# EAGLE schematic baru (EAGLE 7.6.0)
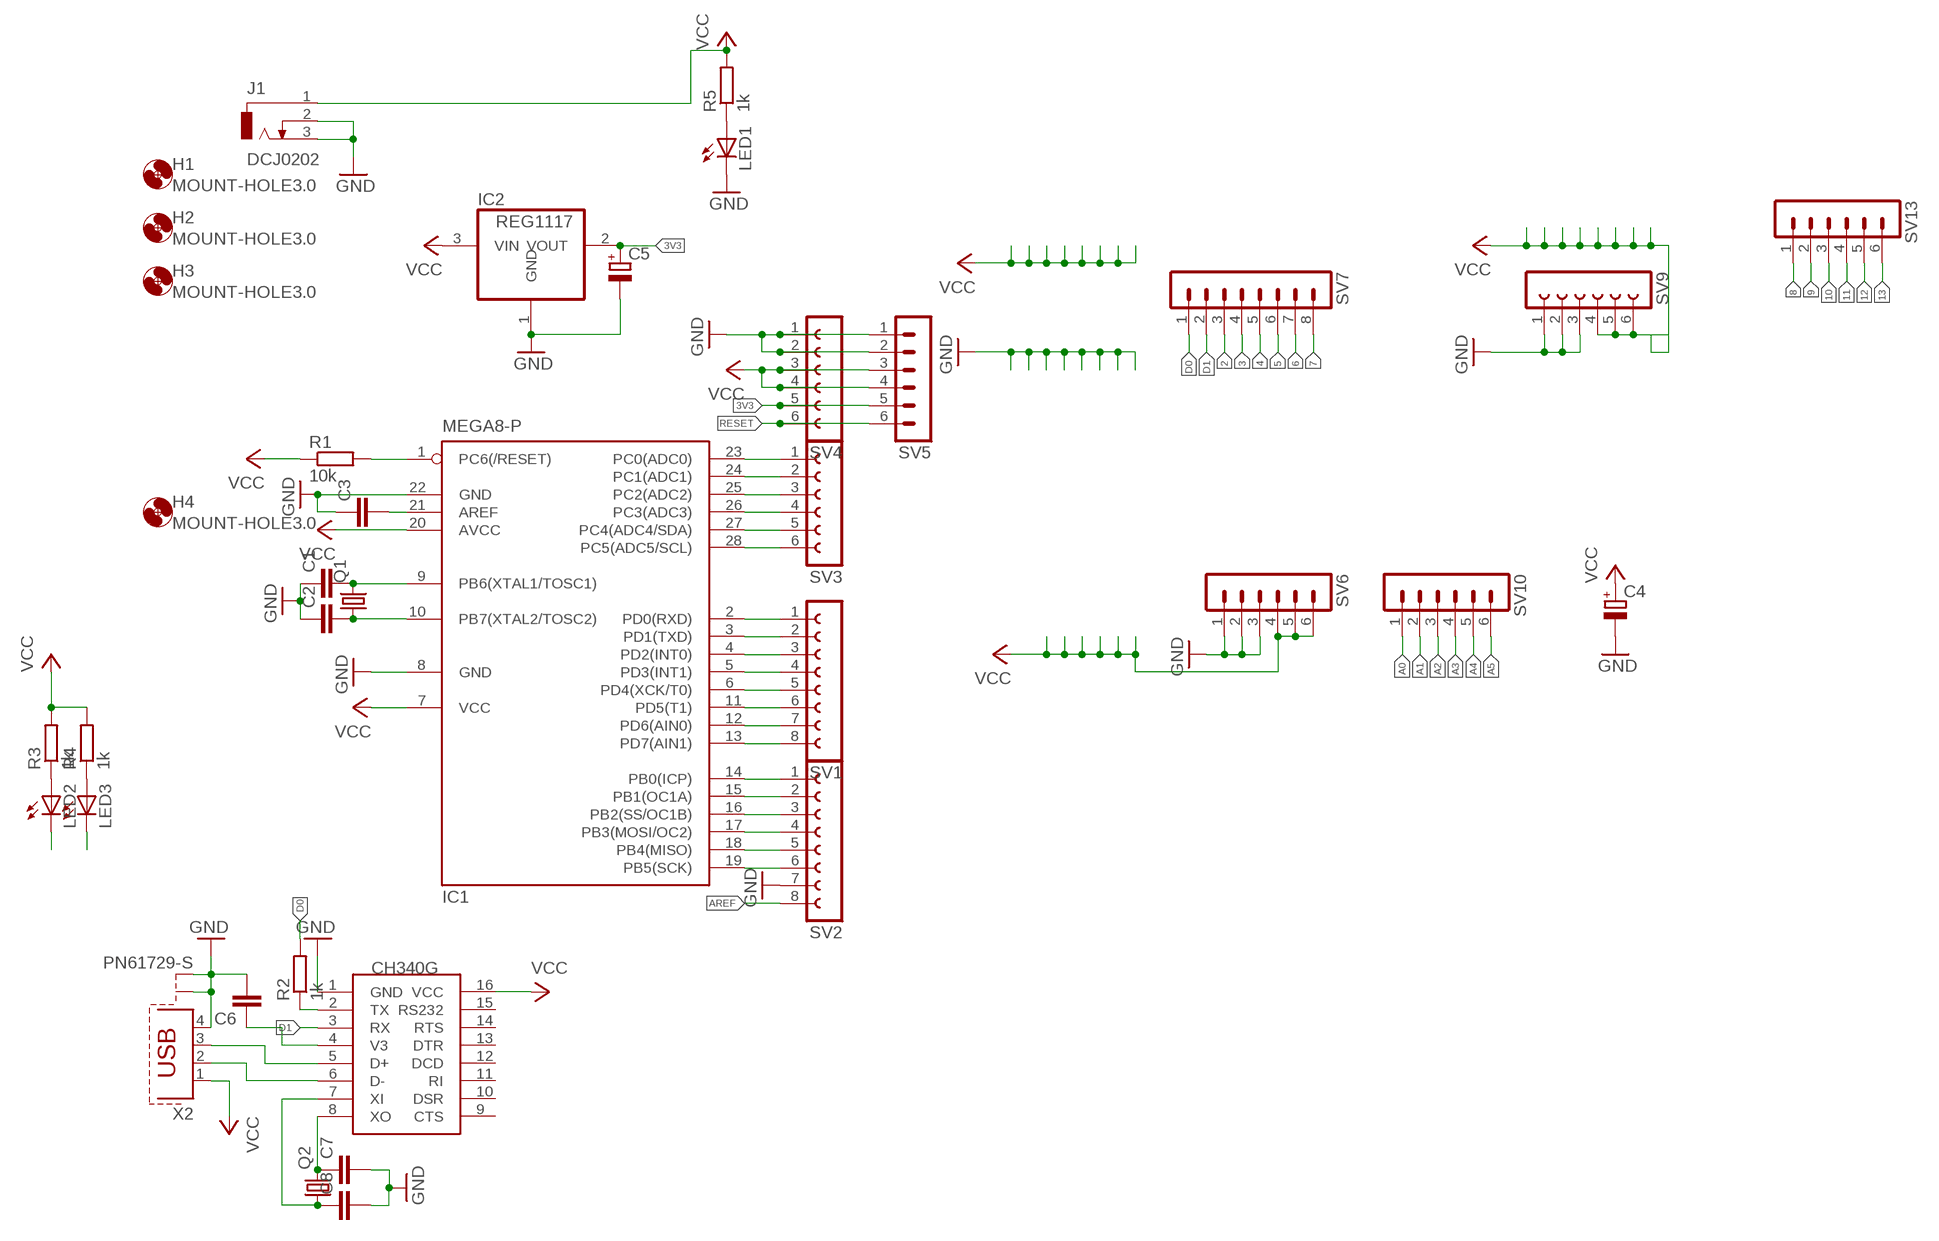
[diagram p0: schematic, sheet 1]

## Parts
C1  C-EU025-025X050  [C025-025X050]
C2  C-EU025-025X050  [C025-025X050]
C3  C-EU050-024X044  [C050-024X044]
C4  CPOL-EUE2.5-7  [E2,5-7]
C5  CPOL-EUE2.5-5  [E2,5-5]
C6  C-EU050-024X044  [C050-024X044]
C7  C-EU025-025X050  [C025-025X050]
C8  C-EU025-025X050  [C025-025X050]
H1  MOUNT-HOLE3.0  [3,0]
H2  MOUNT-HOLE3.0  [3,0]
H3  MOUNT-HOLE3.0  [3,0]
H4  MOUNT-HOLE3.0  [3,0]
IC1  MEGA8-P  [DIL28-3]
IC2  REG1117  [SOT223]
J1  DCJ0202  [DCJ0202]
LED1  LED3MM  [LED3MM]
LED2  LED3MM  [LED3MM]
LED3  LED3MM  [LED3MM]
Q1  CRYSTALHC49S  [HC49/S]
Q2  CRYSTALHC49S  [HC49/S]
R1  10k  R-EU_0207/10  [0207/10]
R2  1k  R-EU_0207/10  [0207/10]
R3  1k  R-EU_0207/10  [0207/10]
R4  1k  R-EU_0207/10  [0207/10]
R5  1k  R-EU_0207/10  [0207/10]
SV1  FE08-1  [FE08]
SV2  FE08-1  [FE08]
SV3  FE06-1  [FE06]
SV4  FE06-1  [FE06]
SV5  MA06-1  [MA06-1]
SV6  MA06-1  [MA06-1]
SV7  MA08-1  [MA08-1]
SV9  FE06-1  [FE06]
SV10  MA06-1  [MA06-1]
SV13  MA06-1  [MA06-1]
U$1  CH340G  [SOIC16]
X2  PN61729-S  [PN61729-S]

## Nets
2: IC1.4(PD2(INT0)) SV1.3 SV7.3
3: IC1.5(PD3(INT1)) SV1.4 SV7.4
3V3: C5.+ IC2.2(VOUT) SV4.5 SV5.5
4: IC1.6(PD4(XCK/T0)) SV1.5 SV7.5
5: IC1.11(PD5(T1)) SV1.6 SV7.6
6: IC1.12(PD6(AIN0)) SV1.7 SV7.7
7: IC1.13(PD7(AIN1)) SV1.8 SV7.8
8: IC1.14(PB0(ICP)) SV2.1 SV13.1
9: IC1.15(PB1(OC1A)) SV2.2 SV13.2
10: IC1.16(PB2(SS/OC1B)) SV2.3 SV13.3
11: IC1.17(PB3(MOSI/OC2)) SV2.4 SV13.4
12: IC1.18(PB4(MISO)) SV2.5 SV13.5
13: IC1.19(PB5(SCK)) SV2.6 SV13.6
A0: IC1.23(PC0(ADC0)) SV3.1 SV10.1
A1: IC1.24(PC1(ADC1)) SV3.2 SV10.2
A2: IC1.25(PC2(ADC2)) SV3.3 SV10.3
A3: IC1.26(PC3(ADC3)) SV3.4 SV10.4
A4: IC1.27(PC4(ADC4/SDA)) SV3.5 SV10.5
A5: IC1.28(PC5(ADC5/SCL)) SV3.6 SV10.6
AREF: C3.2 IC1.21(AREF) SV2.8
D0: IC1.2(PD0(RXD)) R2.2 SV1.1 SV7.1
D1: IC1.3(PD1(TXD)) LED2.K(C) SV1.2 SV7.2 U$1.3(RX)
GND: C1.1 C2.1 C3.1 C4.- C5.- C6.2 C7.2 C8.2 IC1.8(GND) IC1.22(GND) IC2.1(GND) J1.2 J1.3 LED1.K(C) SV2.7 SV4.1 SV4.2 SV5.1 SV5.2 SV6.1 SV6.2 SV6.3 SV9.1 SV9.2 SV9.3 U$1.1(GND) X2.4 X2.S1 X2.S2
N$2: U$1.6(D-) X2.2
N$3: U$1.5(D+) X2.3
N$4: C1.2 IC1.9(PB6(XTAL1/TOSC1)) Q1.2
N$5: C2.2 IC1.10(PB7(XTAL2/TOSC2)) Q1.1
N$6: C6.1 U$1.4(V3)
N$7: LED2.A R3.1
N$8: LED3.A R4.1
N$9: LED1.A R5.1
N$10: C7.1 Q2.2 U$1.8(XO)
N$11: C8.1 Q2.1 U$1.7(XI)
RESET: IC1.1(PC6(/RESET)) R1.2 SV4.6 SV5.6
TX: LED3.K(C) R2.1 U$1.2(TX)
VCC: C4.+ IC1.7(VCC) IC1.20(AVCC) IC2.3(VIN) J1.1 R1.1 R3.2 R4.2 R5.2 SV4.3 SV4.4 SV5.3 SV5.4 SV6.4 SV6.5 SV6.6 SV9.4 SV9.5 SV9.6 U$1.16(VCC) X2.1
Unconnected: U$1.9(CTS) U$1.10(DSR) U$1.11(RI) U$1.12(DCD) U$1.13(DTR) U$1.14(RTS) U$1.15(RS232)

## Library data of the parts
C1-C3 C6-C8 = rcl:C-EU: CAPACITOR, European symbol
C4 C5 = rcl:CPOL-EU: POLARIZED CAPACITOR, European symbol
H1-H4 = holes:MOUNT-HOLE: MOUNTING HOLE with drill center marker
IC1 = atmel:MEGA8-P: MICROCONTROLLER 8 Kbytes FLASH, 1 kbytes SRAM, 512 bytes EEPROM, USART, 4-channel 10 bit ADC, 2-channel 8 bit ADC Pin compatible with Atmega48, ATMega88, ATMega168 Source: avr.lbr; OC_FARNELL: unknown; OC_NEWARK: unknown
IC2 = burr-brown:REG1117: 800mA and 1A Low Dropout (LDO) Positive Regulator 1.8V, 2.5V, 2.85V, 3.3V, 5V, and Adj; MPN: REG1117; OC_FARNELL: 1097566; OC_NEWARK: 14P6981
J1 = con-jack:DCJ0202: DC POWER JACK Source: DCJ0202.pdf; OC_FARNELL: unknown; OC_NEWARK: unknown
LED1-LED3 = led:LED: LED OSRAM: - CHIPLED LG R971, LG N971, LY N971, LG Q971, LY Q971, LO R971, LY R971 LH N974, LH R974 LS Q976, LO Q976, LY Q976 LO Q996 - Hyper CHIPLED LW Q18S LB Q993, LB Q99A, LB R99A - SideLED LS A670, LO A670, LY A670, LG A670, LP A670 LB A673, LV A673, LT A673, LW A673 LH A674 LY A675 LS A676, LA A676, LO A676, LY A676, LW A676 LS A679, LY A679, LG A679 - Hyper Micro SIDELED® LS Y876, LA Y876, LO Y876, LY Y876 LT Y87S - SmartLED LW L88C, LW L88S LB L89C, LB L89S, LG L890 LS L89K, LO L89K, LY L89K LS L896, LA L896, LO L896, LY L896 - TOPLED LS T670, LO T670, LY T670, LG T670, LP T670 LSG T670, LSP T670, LSY T670, LOP T670, LYG T670 LG T671, LOG T671, LSG T671 LB T673, LV T673, LT T673, LW T673 LH T674 LS T676, LA T676, LO T676, LY T676, LB T676, LH T676, LSB T676, LW T676 LB T67C, LV T67C, LT T67C, LS T67K, LO T67K, LY T67K, LW E67C LS E67B, LA E67B, LO E67B, LY E67B, LB E67C, LV E67C, LT E67C LW T67C LS T679, LY T679, LG T679 LS T770, LO T770, LY T770, LG T770, LP T770 LB T773, LV T773, LT T773, LW T773 LH T774 LS E675, LA E675, LY E675, LS T675 LS T776, LA T776, LO T776, LY T776, LB T776 LHGB T686 LT T68C, LB T68C - Hyper Mini TOPLED® LB M676 - Mini TOPLED Santana® LG M470 LS M47K, LO M47K, LY M47K Source: http://www.osram.convergy.de LUXEON: - LUMILED® LXK2-PW12-R00, LXK2-PW12-S00, LXK2-PW14-U00, LXK2-PW14-V00 LXK2-PM12-R00, LXK2-PM12-S00, LXK2-PM14-U00 LXK2-PE12-Q00, LXK2-PE12-R00, LXK2-PE12-S00, LXK2-PE14-T00, LXK2-PE14-U00 LXK2-PB12-K00, LXK2-PB12-L00, LXK2-PB12-M00, LXK2-PB14-N00, LXK2-PB14-P00, LXK2-PB14-Q00 LXK2-PR12-L00, LXK2-PR12-M00, LXK2-PR14-Q00, LXK2-PR14-R00 LXK2-PD12-Q00, LXK2-PD12-R00, LXK2-PD12-S00 LXK2-PH12-R00, LXK2-PH12-S00 LXK2-PL12-P00, LXK2-PL12-Q00, LXK2-PL12-R00 Source: www.luxeon.com KINGBRIGHT: KA-3528ASYC Source: www.kingbright.com
Q1 Q2 = crystal:CRYSTAL: CRYSTAL; OC_FARNELL: 1667008; OC_NEWARK: unknown
R1-R5 = resistor:R-EU_: RESISTOR, European symbol
SV1 SV2 = con-lsta:FE08-1: FEMALE HEADER; OC_FARNELL: unknown; OC_NEWARK: unknown
SV3 SV4 SV9 = con-lsta:FE06-1: FEMALE HEADER; OC_FARNELL: unknown; OC_NEWARK: unknown
SV5 SV6 SV10 SV13 = con-lstb:MA06-1: PIN HEADER; OC_FARNELL: unknown; OC_NEWARK: unknown
SV7 = con-lstb:MA08-1: PIN HEADER; OC_FARNELL: unknown; OC_NEWARK: unknown
U$1 = ch340g:CH340G
X2 = con-berg:PN61729-S: BERG USB connector; OC_FARNELL: unknown; OC_NEWARK: unknown